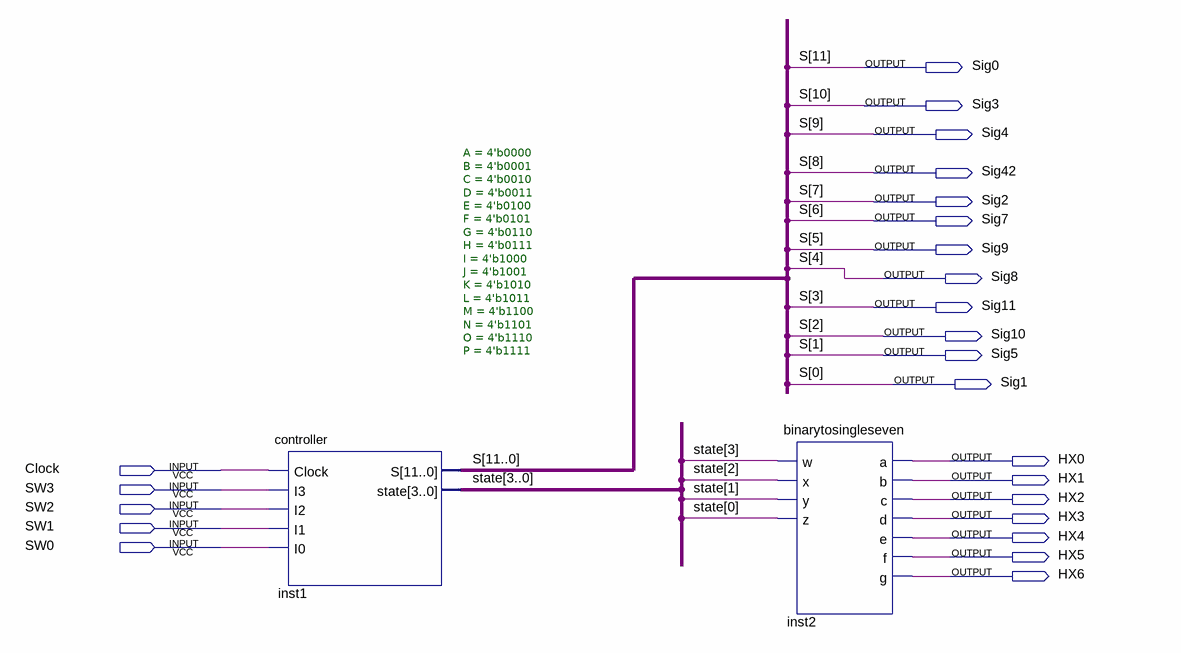
[diagram p0: schematic sheet]
// Quartus schematic COutput.bdf as structural Verilog: 2 symbols, 24 pins
module COutput (
  input  Clock,
  input  SW3,
  input  SW2,
  input  SW1,
  input  SW0,
  output Sig0,
  output Sig3,
  output Sig4,
  output Sig42,
  output Sig2,
  output Sig7,
  output Sig9,
  output Sig8,
  output Sig11,
  output Sig10,
  output Sig5,
  output Sig1,
  output HX0,
  output HX1,
  output HX2,
  output HX3,
  output HX4,
  output HX5,
  output HX6
);

  wire [3:0] state;

  controller #(.A(4'b0000), .B(4'b0001), .C(4'b0010), .D(4'b0011), .E(4'b0100), .F(4'b0101), .G(4'b0110), .H(4'b0111), .I(4'b1000), .J(4'b1001), .K(4'b1010), .L(4'b1011), .M(4'b1100), .N(4'b1101), .O(4'b1110), .P(4'b1111)) inst1 (
    .Clock(Clock), .I3(SW3), .I2(SW2), .I1(SW1), .I0(SW0),
    .S({Sig0, Sig3, Sig4, Sig42, Sig2, Sig7, Sig9, Sig8, Sig11, Sig10, Sig5, Sig1}), .state(state));
  binarytosingleseven inst2 (
    .w(state[3]), .x(state[2]), .y(state[1]), .z(state[0]), .a(HX0), .b(HX1), .c(HX2), .d(HX3), .e(HX4),
    .f(HX5), .g(HX6));

  // Other names for the same wires on the sheet: S[11:0] = {Sig0, Sig3, Sig4, Sig42, Sig2, Sig7, Sig9, Sig8, Sig11, Sig10, Sig5, Sig1}
endmodule
